# Altium schematic sheet micro.SchDoc
size A3
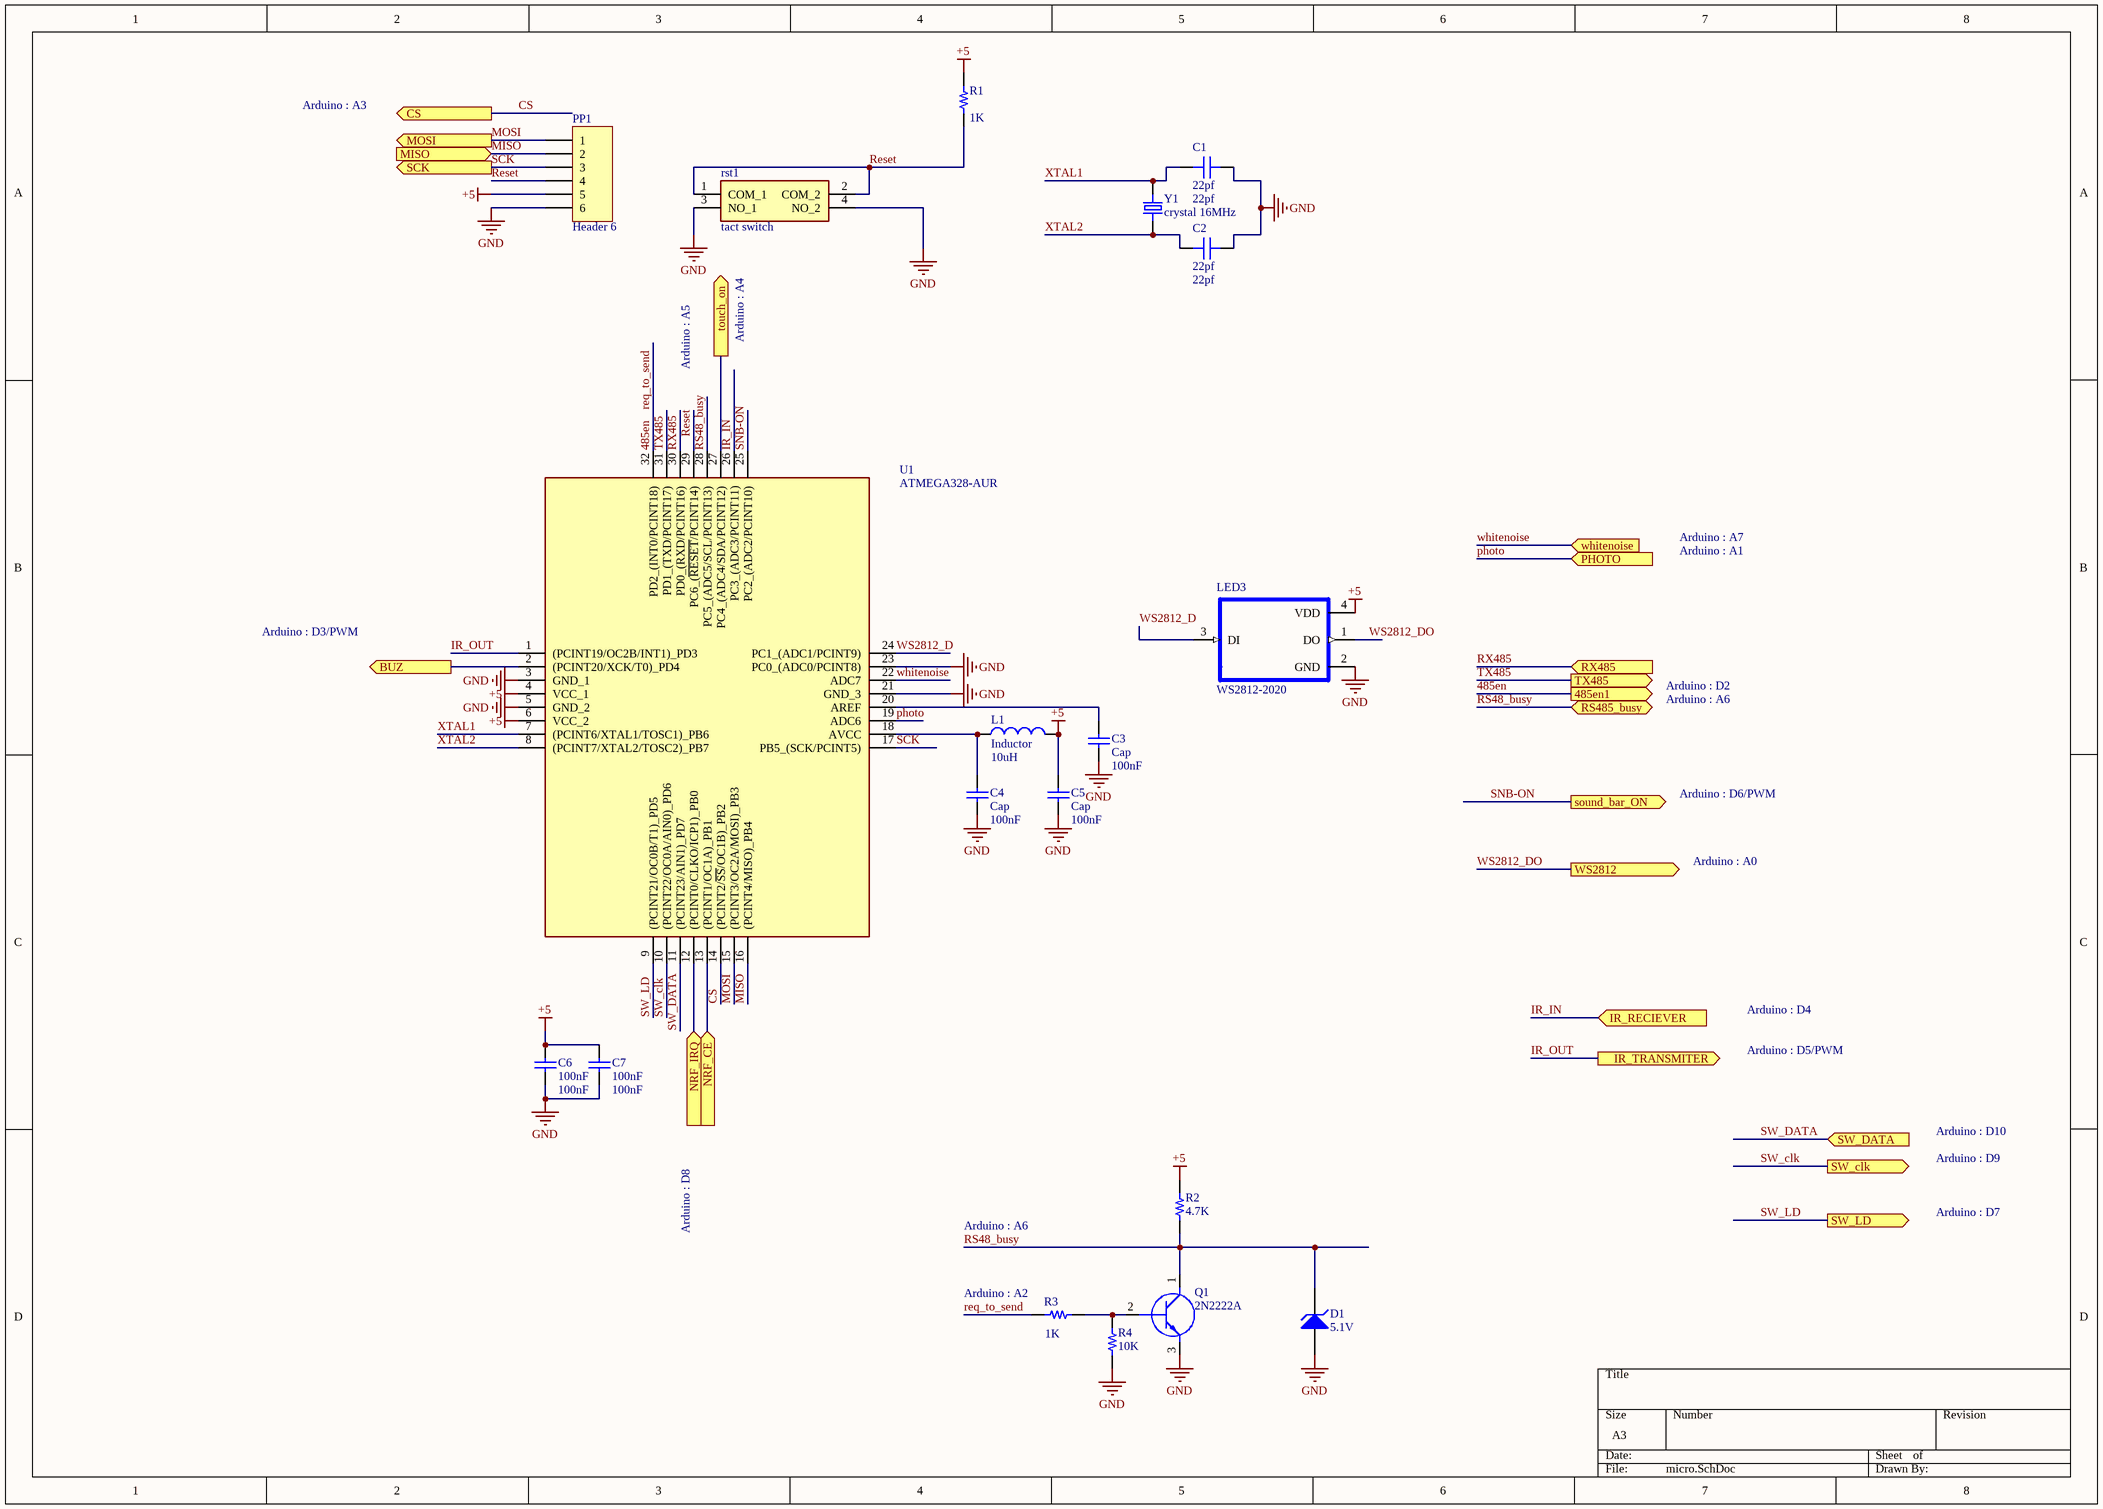
[diagram p0: micro.SchDoc]

## Parts
C1  22pf  [0603C]
C2  22pf  [0603C]
C3  Cap  value 100nF  [0603C]
C4  Cap  value 100nF  [0603C]
C5  Cap  value 100nF  [0603C]
C6  100nF  [0603C]
C7  100nF  [0603C]
D1  5.1V  [Diode 1n4148 SMD]
L1  Inductor  value 10uH  [IND1206]
LED3  WS2812-2020  [LED_WS2812-2020]
PP1  Header 6  [HDR1X6]
Q1  2N2222A  [soT95p280x130-3n]
R1  1K  [0603R]
R2  4.7K  [0603R]
R3  1K  [0603R]
R4  10K  [0603R]
rst1  tact switch  [DTSM63NVB]
U1  ATMEGA328-AUR  [TQFP32_N]
Y1  crystal 16MHz  [XTAL_ECS-180-S-5P-DN-TR]

## Ports
485en1 (out), BUZ (out), CS (out), IR_RECIEVER (in), IR_TRANSMITER (out), MISO (in), MOSI (out), NRF_CE (in), NRF_IRQ (in), PHOTO (in), RS485_busy (bidir), RX485 (in), SCK (out), sound_bar_ON (out), SW_clk (out), SW_DATA (in), SW_LD (out), touch_on (out), TX485 (out), whitenoise (in), WS2812 (out)

## Nets
+5: C5.1 C6.1 C7.1 L1.2 LED3.4(VDD) PP1.5 R1.2 R2.1 U1.4(VCC_1) U1.6(VCC_2)
GND: C1.1 C2.1 C3.2 C4.2 C5.2 C6.2 C7.2 D1.1(A) LED3.2(GND) PP1.6 Q1.3(E) R4.2 rst1.3(NO_1) rst1.4(NO_2) U1.3(GND_1) U1.5(GND_2) U1.21(GND_3) U1.23(PC0_(ADC0/PCINT8))
485en: R3.2 U1.32(PD2_(INT0/PCINT18)) ; port 485en1  [also labelled req_to_send]
BUZ: U1.2((PCINT20/XCK/T0)_PD4) ; port BUZ
CS: U1.14((PCINT2/~{SS}/OC1B)_PB2) ; port CS
IR_IN: U1.26(PC3_(ADC3/PCINT11)) ; port IR_RECIEVER
IR_OUT: U1.1((PCINT19/OC2B/INT1)_PD3) ; port IR_TRANSMITER
MISO: PP1.2 U1.16((PCINT4/MISO)_PB4) ; port MISO
MOSI: PP1.1 U1.15((PCINT3/OC2A/MOSI)_PB3) ; port MOSI
NRF_CE: U1.13((PCINT1/OC1A)_PB1) ; port NRF_CE
NRF_IRQ: U1.12((PCINT0/CLKO/ICP1)_PB0) ; port NRF_IRQ
photo: U1.19(ADC6) ; port PHOTO
Reset: PP1.4 R1.1 rst1.1(COM_1) rst1.2(COM_2) U1.29(PC6_(~{RESET}/PCINT14))
RS48_busy: D1.2(K) Q1.1(C) R2.2 U1.28(PC5_(ADC5/SCL/PCINT13)) ; port RS485_busy
RX485: U1.30(PD0_(RXD/PCINT16)) ; port RX485
SCK: PP1.3 U1.17(PB5_(SCK/PCINT5)) ; port SCK
SNB-ON: U1.25(PC2_(ADC2/PCINT10)) ; port sound_bar_ON
SW_clk: U1.10((PCINT22/OC0A/AIN0)_PD6) ; port SW_clk
SW_DATA: U1.11((PCINT23/AIN1)_PD7) ; port SW_DATA
SW_LD: U1.9((PCINT21/OC0B/T1)_PD5) ; port SW_LD
touch_on: U1.27(PC4_(ADC4/SDA/PCINT12)) ; port touch_on
TX485: U1.31(PD1_(TXD/PCINT17)) ; port TX485
whitenoise: U1.22(ADC7) ; port whitenoise
WS2812_D: LED3.3(DI) U1.24(PC1_(ADC1/PCINT9))
WS2812_DO: LED3.1(DO) ; port WS2812
XTAL1: C1.2 U1.7((PCINT6/XTAL1/TOSC1)_PB6) Y1.2
XTAL2: C2.2 U1.8((PCINT7/XTAL2/TOSC2)_PB7) Y1.1
NetC3_1: C3.1 U1.20(AREF)
NetC4_1: C4.1 L1.1 U1.18(AVCC)
NetQ1_2: Q1.2(B) R3.1 R4.1

## Notes on the sheet
- Arduino : A3
- Arduino : A5
- Arduino : A4
- Arduino : A1
- Arduino : A7
- Arduino : D3/PWM
- Arduino : D2
- Arduino : A6
- Arduino : D6/PWM
- Arduino : A0
- Arduino : D5/PWM
- Arduino : D4
- Arduino : D10
- Arduino : D9
- Arduino : D8
- Arduino : D7
- (near R3) Arduino : A2

## Library data of the parts
C1 C2 = Capacitor: CAP SMD 0603; Part Number: C0805X106K9RAC7800; Value: 22pf
C3-C5 = Cap: Capacitor; Published: 8-Jun-2000; LatestRevisionDate: 17-Jul-2002; LatestRevisionNote: Re-released for DXP Platform.; PackageReference: RAD-0.3; Publisher: Altium Limited; PackageDescription: Radial Cap, Thru-Hole; 2 Leads; 0.3 in Pin Spacing
C6 C7 = Cap: CAP SMD 0603; Published: 8-Jun-2000; LatestRevisionDate: 17-Jul-2002; LatestRevisionNote: Re-released for DXP Platform.; PackageReference: RAD-0.3; Publisher: Altium Limited; PackageDescription: Radial Cap, Thru-Hole; 2 Leads; 0.3 in Pin Spacing; Value: 100nF
D1 = D Zener: Zener Diode 5.1v; Published: 8-Jun-2000; LatestRevisionDate: 17-Jul-2002; LatestRevisionNote: Re-released for DXP Platform.; PackageReference: DIODE-0.7; Publisher: Altium Limited; PackageDescription: Diode, Thru-Hole; 2 Leads; 0.7 in Pin Spacing
L1 = Inductor: Code_IEC: 1005; Published: 8-Jun-2000; LatestRevisionDate: 29-May-2009; LatestRevisionNote: IPC-7351 Footprint Added.; PackageReference: 0402-A; Publisher: Altium Limited; PackageDescription: Chip Inductor; Code_JEITA: 0402
LED3 = WS2812-2020: Intelligent control LED integrated light source; MF: Worldsemi; SnapEDA_Link: https://www.snapeda.com/parts/WS2812-2020/Worldsemi/view-part/2873751/?ref=snap; Package: Package Analog Devices; MP: WS2812-2020; Value: *; Availability: Unavailable; Price: None
PP1 = Header 6: Header, 6-Pin , female; LatestRevisionDate: 17-Jul-2002; LatestRevisionNote: Re-released for DXP Platform.; Publisher: Altium Limited
Q1 = 2N2222A: Transistor BJT NPN SMD; pin to pad: 1>3 2>1 3>2; Manufacturer_Name: Foshan Blue Rocket Elec; Datasheet Link: https://datasheet.lcsc.com/szlcsc/1901291437_Foshan-Blue-Rocket-Elec-2N2222A_C358533.pdf; Height: 4.7mm; Manufacturer_Part_Number: 2N2222A
R1-R4 = Resistor: RES SMD 0603; Part Number: RCS0805100KFKEA
  R1 R3: Value: 1K
  R2: Value: 4.7K
  R4: Value: 10K
rst1 = DTSM-66R-V-T_R: Push Button SMD - 4PIN; Manufacturer_Name: Diptronics; Manufacturer_Part_Number: DTSM-66R-V-T/R; Datasheet Link: https://www.mouser.co.uk/datasheet/2/910/464_DTSMJ-6-1571536.pdf; Height: 7.1mm; Mouser Part Number: 113-DTSM66RVTR; Mouser Price/Stock: https://www.mouser.co.uk/ProductDetail/Diptronics/DTSM-66R-V-T-R?qs=MLItCLRbWsxl2%252BVY862AIw%3D%3D
U1 = ATMEGA328-AUR: Integrated Circuit; Manufacturer_Name: Microchip; Datasheet Link: https://componentsearchengine.com/Datasheets/1/ATMEGA328-AUR.pdf; Height: 1.2mm; Manufacturer_Part_Number: ATMEGA328-AUR; Mouser Part Number: 556-ATMEGA328-AUR; Mouser Price/Stock: https://www.mouser.co.uk/ProductDetail/Microchip-Technology-Atmel/ATMEGA328-AUR?qs=lwdSMh1%2FoYLfe%252B5OKFEFrw%3D%3D; Arrow Part Number: ATMEGA328-AUR; Arrow Price/Stock: https://www.arrow.com/en/products/atmega328-aur/microchip-technology
Y1 = ECS-180-S-5P-DN-TR: Crystals 16MHz; MF: ECS International; MP: ECS-180-S-5P-DN-TR; Value: 16MHz; SnapEDA_Link: https://www.snapeda.com/parts/ECS-180-S-5P-DN-TR/ECS%20International/view-part/2547669/?ref=snap; Price: None; Package: HC49/US ECS International; Availability: Unavailable